# EAGLE schematic PSU3 (EAGLE 9.4.2)
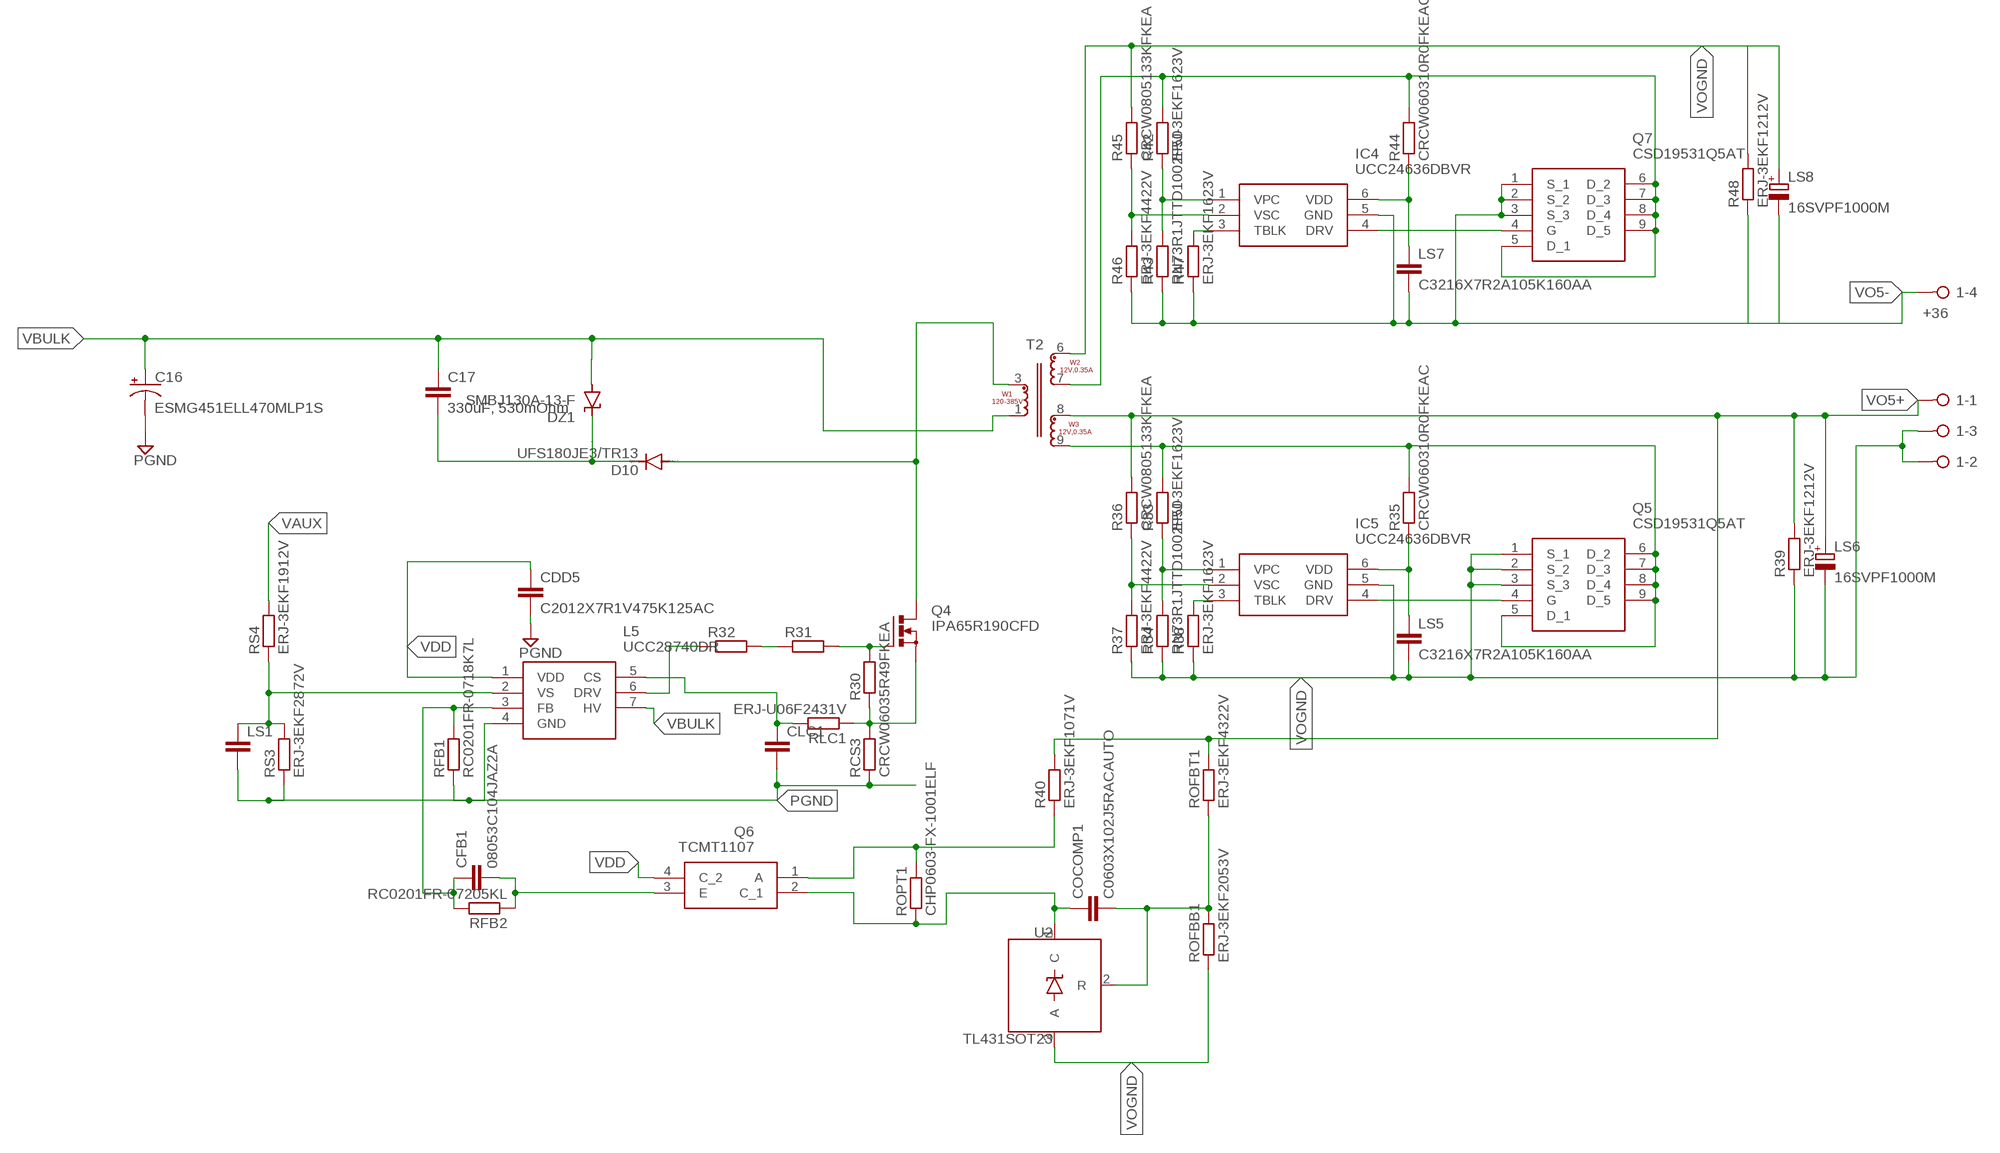
[diagram p0: schematic, sheet 1]

## Parts
1  +36  W237-04P  [W237-4P]
C16  ESMG451ELL470MLP1S  CPOL-USE7.5-16  [E7,5-16]
C17  330uF, 530mOhm  C-EUC0805  [C0805]
CDD5  C2012X7R1V475K125AC  C-EUC0805  [C0805]
CFB1  08053C104JAZ2A  C-EUC0805  [C0805]
CLC1  C-EUC0603  [C0603]
COCOMP1  C0603X102J5RACAUTO  C-EUC0603  [C0603]
D10  UFS180JE3/TR13  DIODE-DO214BA  [DO214BA]
DZ1  SMBJ130A-13-F  SUPPRESSOR-SMBJ  [SMBJ]
IC4  UCC24636DBVR  [SOT95P280X145-6N]
IC5  UCC24636DBVR  [SOT95P280X145-6N]
L5  UCC28740DR  [D(R-PDSO-G7)]
LS1  C-EUC0805  [C0805]
LS5  C3216X7R2A105K160AA  C-EUC1206  [C1206]
LS6  16SVPF1000M  CPOL-EU153CLV-0810  [153CLV-0810]
LS7  C3216X7R2A105K160AA  C-EUC1206  [C1206]
LS8  16SVPF1000M  CPOL-EU153CLV-0810  [153CLV-0810]
Q4  IPA65R190CFD  PMOSFET_NTO220BV  [TO220BV]
Q5  CSD19531Q5AT  [CSD19531Q5AT]
Q6  TCMT1107  [SOIC127P700X230-4N]
Q7  CSD19531Q5AT  [CSD19531Q5AT]
R30  R-EU_R0805  [R0805]
R31  R-EU_R0805  [R0805]
R32  R-EU_R0805  [R0805]
R33  ERJ-3EKF1623V  R-EU_R0603  [R0603]
R34  RN73R1JTTD1002F50  R-EU_R0603  [R0603]
R35  CRCW060310R0FKEAC  R-EU_R0805  [R0805]
R36  CRCW0805133KFKEA  R-EU_R0805  [R0805]
R37  ERJ-3EKF4422V  R-EU_R0603  [R0603]
R38  ERJ-3EKF1623V  R-EU_R0603  [R0603]
R39  ERJ-3EKF1212V  R-EU_R0603  [R0603]
R40  ERJ-3EKF1071V  R-EU_R0603  [R0603]
R42  ERJ-3EKF1623V  R-EU_R0603  [R0603]
R43  RN73R1JTTD1002F50  R-EU_R0603  [R0603]
R44  CRCW060310R0FKEAC  R-EU_R0805  [R0805]
R45  CRCW0805133KFKEA  R-EU_R0805  [R0805]
R46  ERJ-3EKF4422V  R-EU_R0603  [R0603]
R47  ERJ-3EKF1623V  R-EU_R0603  [R0603]
R48  ERJ-3EKF1212V  R-EU_R0603  [R0603]
RCS3  CRCW06035R49FKEA  R-EU_R0603  [R0603]
RFB1  RC0201FR-0718K7L  R-EU_R0201  [R0201]
RFB2  RC0201FR-07205KL  R-EU_R0201  [R0201]
RLC1  ERJ-U06F2431V  R-EU_R0805  [R0805]
ROFBB1  ERJ-3EKF2053V  R-EU_R0603  [R0603]
ROFBT1  ERJ-3EKF4322V  R-EU_R0603  [R0603]
ROPT1  CHP0603-FX-1001ELF  R-EU_R0603  [R0603]
RS3  ERJ-3EKF2872V  R-EU_R0603  [R0603]
RS4  ERJ-3EKF1912V  R-EU_R0603  [R0603]
T2  WE-UNIT_7491182112_749118215  [WE-UNIT_E16/8/5]
U2  TL431SOT23  [SOT23-3]

## Nets
N$36: L5.2(VS) LS1.1 RS3.2 RS4.1
N$37: R31.1 R32.2
N$39: Q4.G R30.2 R31.2
N$41: C17.2 D10.C DZ1.C
N$42: D10.A Q4.D T2.3
N$46: CFB1.2 Q6.3(E) RFB2.1
N$47: CFB1.1 L5.3(FB) RFB1.2 RFB2.2
N$48: COCOMP1.2 ROFBB1.2 ROFBT1.1 U2.2(R)
N$49: Q6.1(A) R40.1 ROPT1.2
N$51: COCOMP1.1 Q6.2(C_1) ROPT1.1 U2.1(C)
N$53: IC5.4(DRV) Q5.4(G)
N$54: Q5.5(D_1) Q5.6(D_2) Q5.7(D_3) Q5.8(D_4) Q5.9(D_5) R33.2 R35.2 T2.9
N$58: IC4.4(DRV) Q7.4(G)
N$60: Q7.5(D_1) Q7.6(D_2) Q7.7(D_3) Q7.8(D_4) Q7.9(D_5) R42.2 R44.2 T2.7
N$CS1: CLC1.1 L5.5(CS) RLC1.2
N$DRV1: L5.6(DRV) R32.1
N$TBK1: IC5.3(TBLK) R38.2
N$TBK2: IC4.3(TBLK) R47.2
N$VODD1: IC5.6(VDD) LS5.1 R35.1
N$VODD2: IC4.6(VDD) LS7.1 R44.1
N$VPC1: IC5.1(VPC) R33.1 R34.2
N$VPC2: IC4.1(VPC) R42.1 R43.2
N$VSC1: IC5.2(VSC) R36.1 R37.2
N$VSC2: IC4.2(VSC) R45.1 R46.2
PGND: C16.- CDD5.2 CLC1.2 L5.4(GND) LS1.2 RCS3.1 RFB1.1 RS3.1
TOISENSE1: Q4.S R30.1 RCS3.2 RLC1.1
VAUX: RS4.2
VBULK: C16.+ C17.1 DZ1.A L5.7(HV) T2.1
VDD: CDD5.1 L5.1(VDD) Q6.4(C_2)
VO5+: 1.1 LS6.+ R36.2 R39.2 R40.2 ROFBT1.2 T2.8
VO5-: 1.4 IC4.5(GND) LS7.2 LS8.- Q7.1(S_1) Q7.2(S_2) Q7.3(S_3) R43.1 R46.1 R47.1 R48.1
VOGND: 1.2 1.3 IC5.5(GND) LS5.2 LS6.- LS8.+ Q5.1(S_1) Q5.2(S_2) Q5.3(S_3) R34.1 R37.1 R38.1 R39.1 R45.2 R48.2 ROFBB1.1 T2.6 U2.3(A)

## Library data of the parts
1 = con-wago-508:W237-04P: WAGO SREW CLAMP; OC_FARNELL: unknown; OC_NEWARK: unknown
C16 = rcl:CPOL-US: POLARIZED CAPACITOR, American symbol; SPICEPREFIX: C
C17 CDD5 CFB1 CLC1 COCOMP1 LS1 LS5 LS7 = rcl:C-EU: CAPACITOR, European symbol; SPICEPREFIX: C
D10 = diode:DIODE-: DIODE
DZ1 = diode:SUPPRESSOR-: Suppressor diode
IC4 IC5 = SamacSys_Parts:UCC24636DBVR: Synchronous Rectifier Controller With Ultra-Low Standby Current Source: Datasheet <http://www.ti.com/lit/gpn/ucc24636>; DESCRIPTION: Synchronous Rectifier Controller With Ultra-Low Standby Current; HEIGHT: 1.45mm; MANUFACTURER_NAME: Texas Instruments; MANUFACTURER_PART_NUMBER: UCC24636DBVR; MOUSER_PART_NUMBER: 595-UCC24636DBVR; MOUSER_PRICE-STOCK: https://www.mouser.com/Search/Refine.aspx?Keyword=595-UCC24636DBVR
L5 = SamacSys_Parts:UCC28740DR: Constant-Voltage, Constant-Current Flyback Controller Using Opto-Coupler Feedback Source: Datasheet <http://www.ti.com/lit/gpn/ucc28740>; DESCRIPTION: Constant-Voltage, Constant-Current Flyback Controller Using Opto-Coupler Feedback; HEIGHT: mm; MANUFACTURER_NAME: Texas Instruments; MANUFACTURER_PART_NUMBER: UCC28740DR; MOUSER_PART_NUMBER: 595-UCC28740DR; MOUSER_PRICE-STOCK: https://www.mouser.com/Search/Refine.aspx?Keyword=595-UCC28740DR
LS6 LS8 = rcl:CPOL-EU: POLARIZED CAPACITOR, European symbol; SPICEPREFIX: C
Q4 = transistor-power:PMOSFET_N: Power MOSFET N-Channel
Q5 Q7 = SamacSys_Parts:CSD19531Q5AT: Texas Instruments CSD19531Q5AT N-channel MOSFET Transistor, 110 A, 100 V, 8-Pin VSON Source: Datasheet <http://www.ti.com/general/docs/lit/getliterature.tsp?genericPartNumber=CSD19531Q5A&&fileType=pdf>; DESCRIPTION: Texas Instruments CSD19531Q5AT N-channel MOSFET Transistor, 110 A, 100 V, 8-Pin VSON; HEIGHT: 1mm; MANUFACTURER_NAME: Texas Instruments; MANUFACTURER_PART_NUMBER: CSD19531Q5AT; MOUSER_PART_NUMBER: 595-CSD19531Q5AT; MOUSER_PRICE-STOCK: https://www.mouser.com/Search/Refine.aspx?Keyword=595-CSD19531Q5AT; RS_PART_NUMBER: 8239259P; RS_PRICE-STOCK: http://uk.rs-online.com/web/p/products/8239259P
Q6 = SamacSys_Parts:TCMT1107: Optocoupler Transistor O/P 1-CH Source: Datasheet <https://www.vishay.com/docs/83510/tcmt1100.pdf>; ALLIED_NUMBER: R1083241; ALLIED_PRICE-STOCK: https://www.alliedelec.com/vishaydale-tcmt1107/R1083241/; DESCRIPTION: Optocoupler Transistor O/P 1-CH; HEIGHT: 2.3mm; MANUFACTURER_NAME: Vishay; MANUFACTURER_PART_NUMBER: TCMT1107; MOUSER_PART_NUMBER: 782-TCMT1107; MOUSER_PRICE-STOCK: https://www.mouser.com/Search/Refine.aspx?Keyword=782-TCMT1107; RS_PART_NUMBER: 6998341P; RS_PRICE-STOCK: http://uk.rs-online.com/web/p/products/6998341P
R30-R40 R42-R48 RCS3 RFB1 RFB2 RLC1 ROFBB1 ROFBT1 ROPT1 RS3 RS4 = rcl:R-EU_: RESISTOR, European symbol; SPICEPREFIX: R
T2 = Wurth_Elektronik_Passive_rev18f:WE-UNIT_7491182112: WE-UNIT Off-Line Transformer Characteristics Nominal input voltage: 125–375 VDC (85–265 VAC) Output power 3 W and 9 W Operating temperature: –40 °C to +125 °C Clearance and creepage distance 6 mm min. Insulation test voltage: 4 kVAC, 1 Minute Design compliant to EN 61558-2-16: reinforced insulation; except 749 118 10 xx: Basic insulation Applications Designed for Tiny Switch ICs from Power Integration and NCP101x or 105x of ON Semiconductor For SMPS with universal input from 85 VAC up to 265 VAC <http://katalog.we-online.de/media/images/v2/Family_WE-Unit_off-line_transformer.jpg> Details see: http://katalog.we-online.de/en/pbs/WE-UNIT?m Updated by Dan Xu 2014-07-11 2014 (C) Wurth Elektronik
U2 = SparkFun-DiscreteSemi:TL431: TL431- Voltage Reference Precision Programmable Shunt Regulator Diode Datasheet <https://cdn.sparkfun.com/datasheets/Components/General%20IC/TL431-D.pdf> SparkFun Products: TL431-Voltage Reference PTH <https://www.sparkfun.com/products/11078> SparkFun Uh-Oh Battery Level Indicator <https://www.sparkfun.com/products/11087>